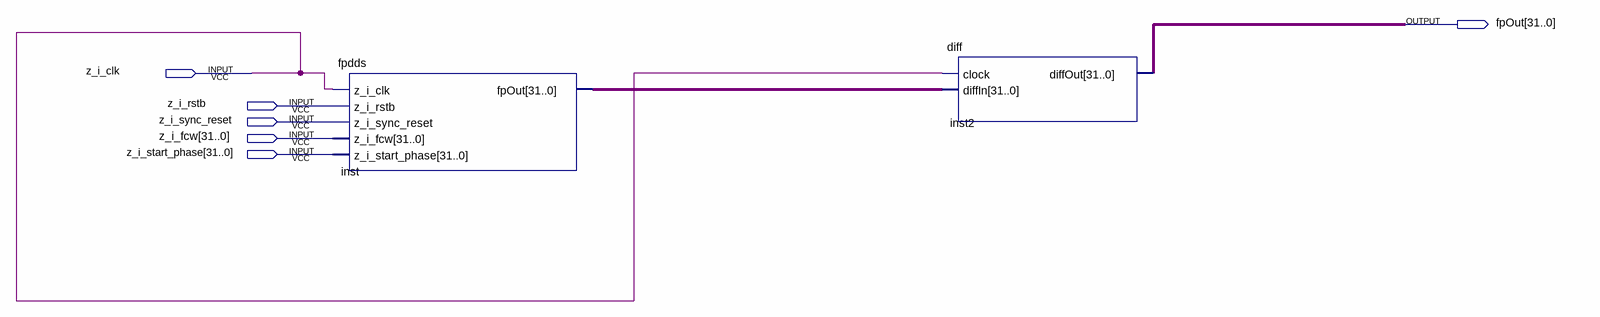
[diagram p0: schematic sheet]
// Quartus schematic div_test.bdf as structural Verilog: 2 symbols, 6 pins
module div_test (
  input  z_i_clk,
  input  z_i_rstb,
  input  z_i_sync_reset,
  input  [31:0] z_i_fcw,
  input  [31:0] z_i_start_phase,
  output [31:0] fpOut
);

  wire [31:0] inst_fpout;

  fpdds inst (
    .z_i_clk(z_i_clk), .z_i_rstb(z_i_rstb), .z_i_sync_reset(z_i_sync_reset), .z_i_fcw(z_i_fcw),
    .z_i_start_phase(z_i_start_phase), .fpOut(inst_fpout));
  diff inst2 (.clock(z_i_clk), .diffIn(inst_fpout), .diffOut(fpOut));
endmodule
